# EAGLE design WirelessBuzzerv20 (EAGLE 6.5.0)
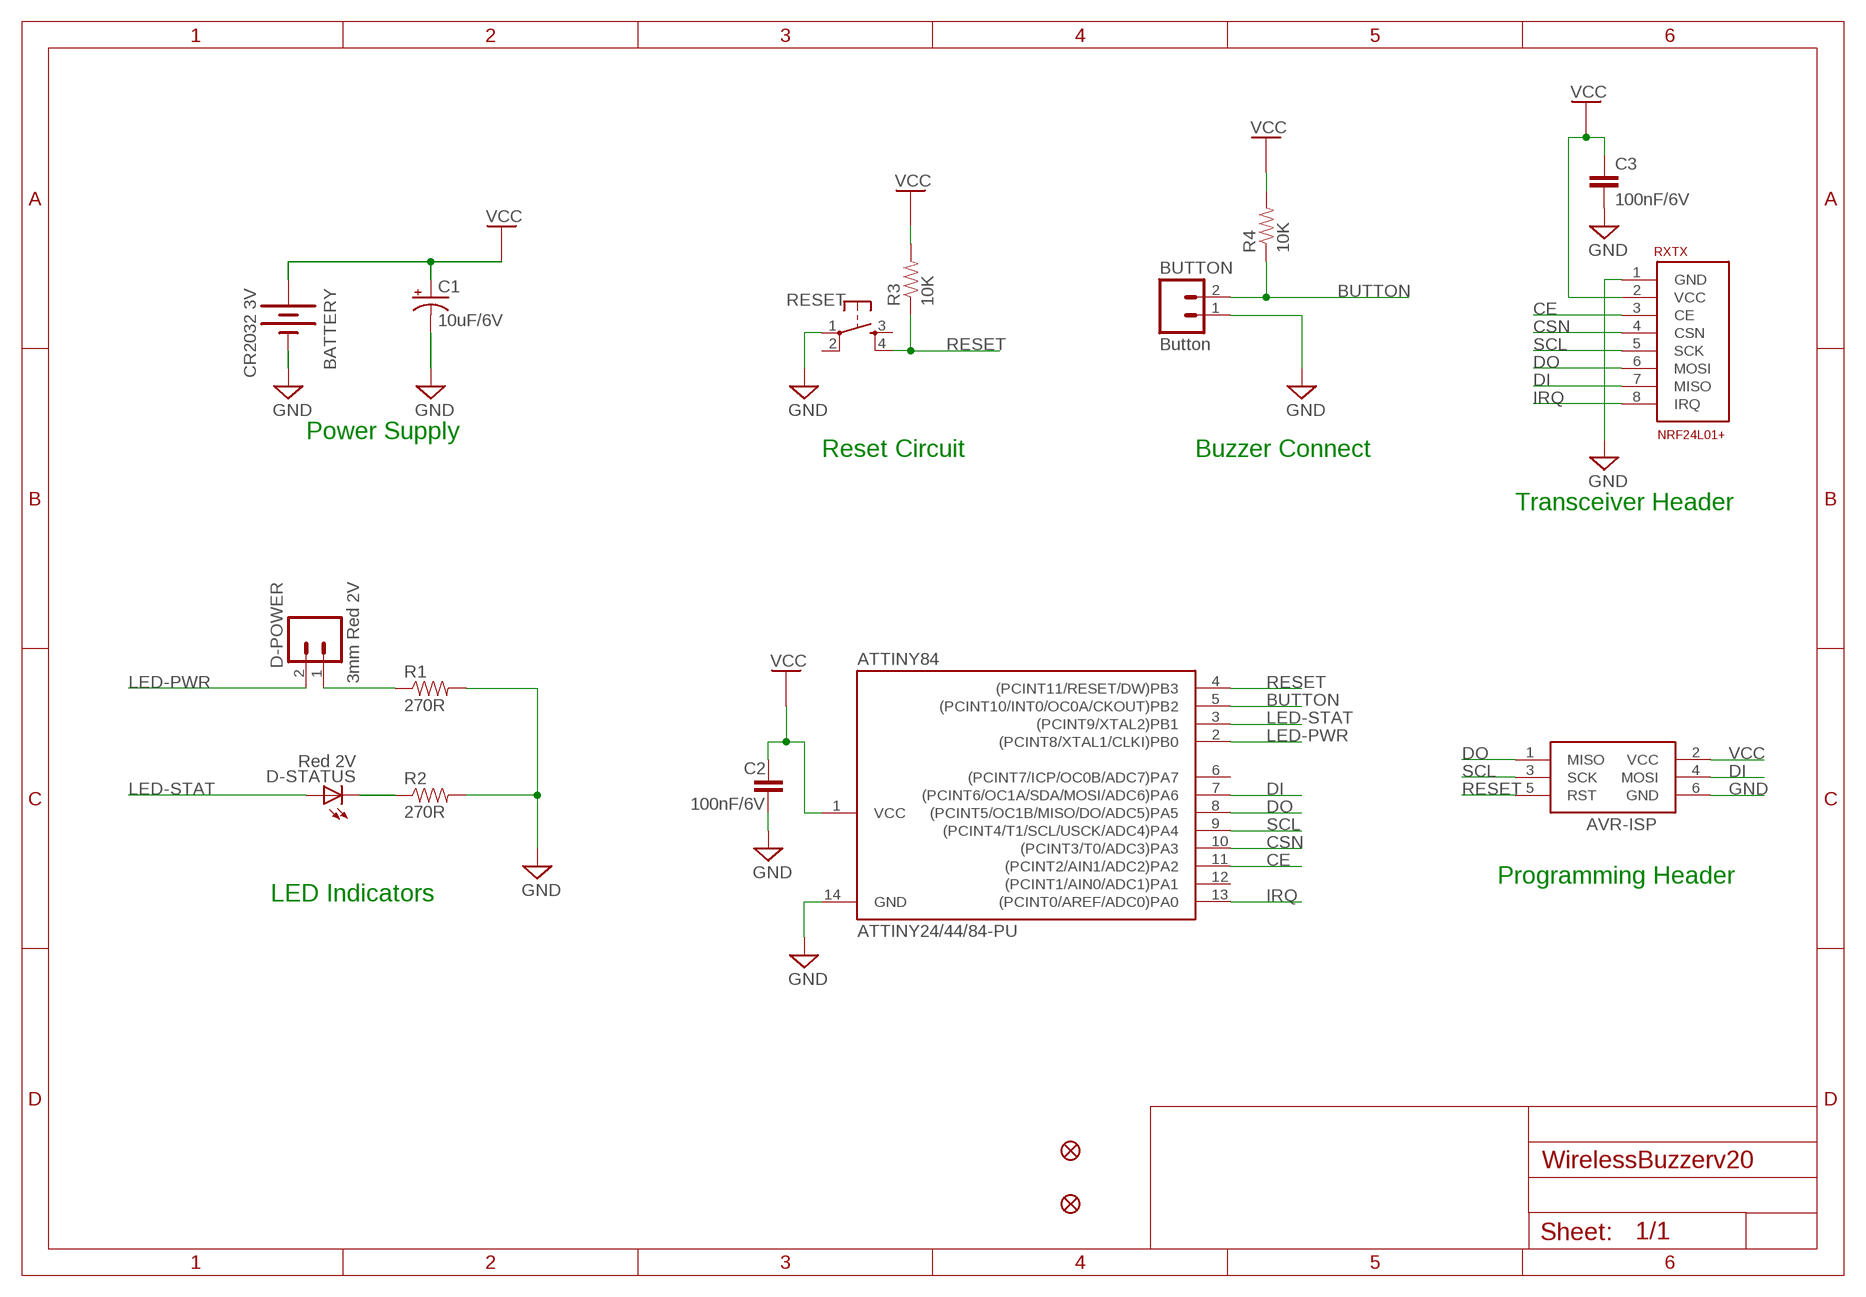
[diagram p0: schematic, sheet 1, part 1 of 2]
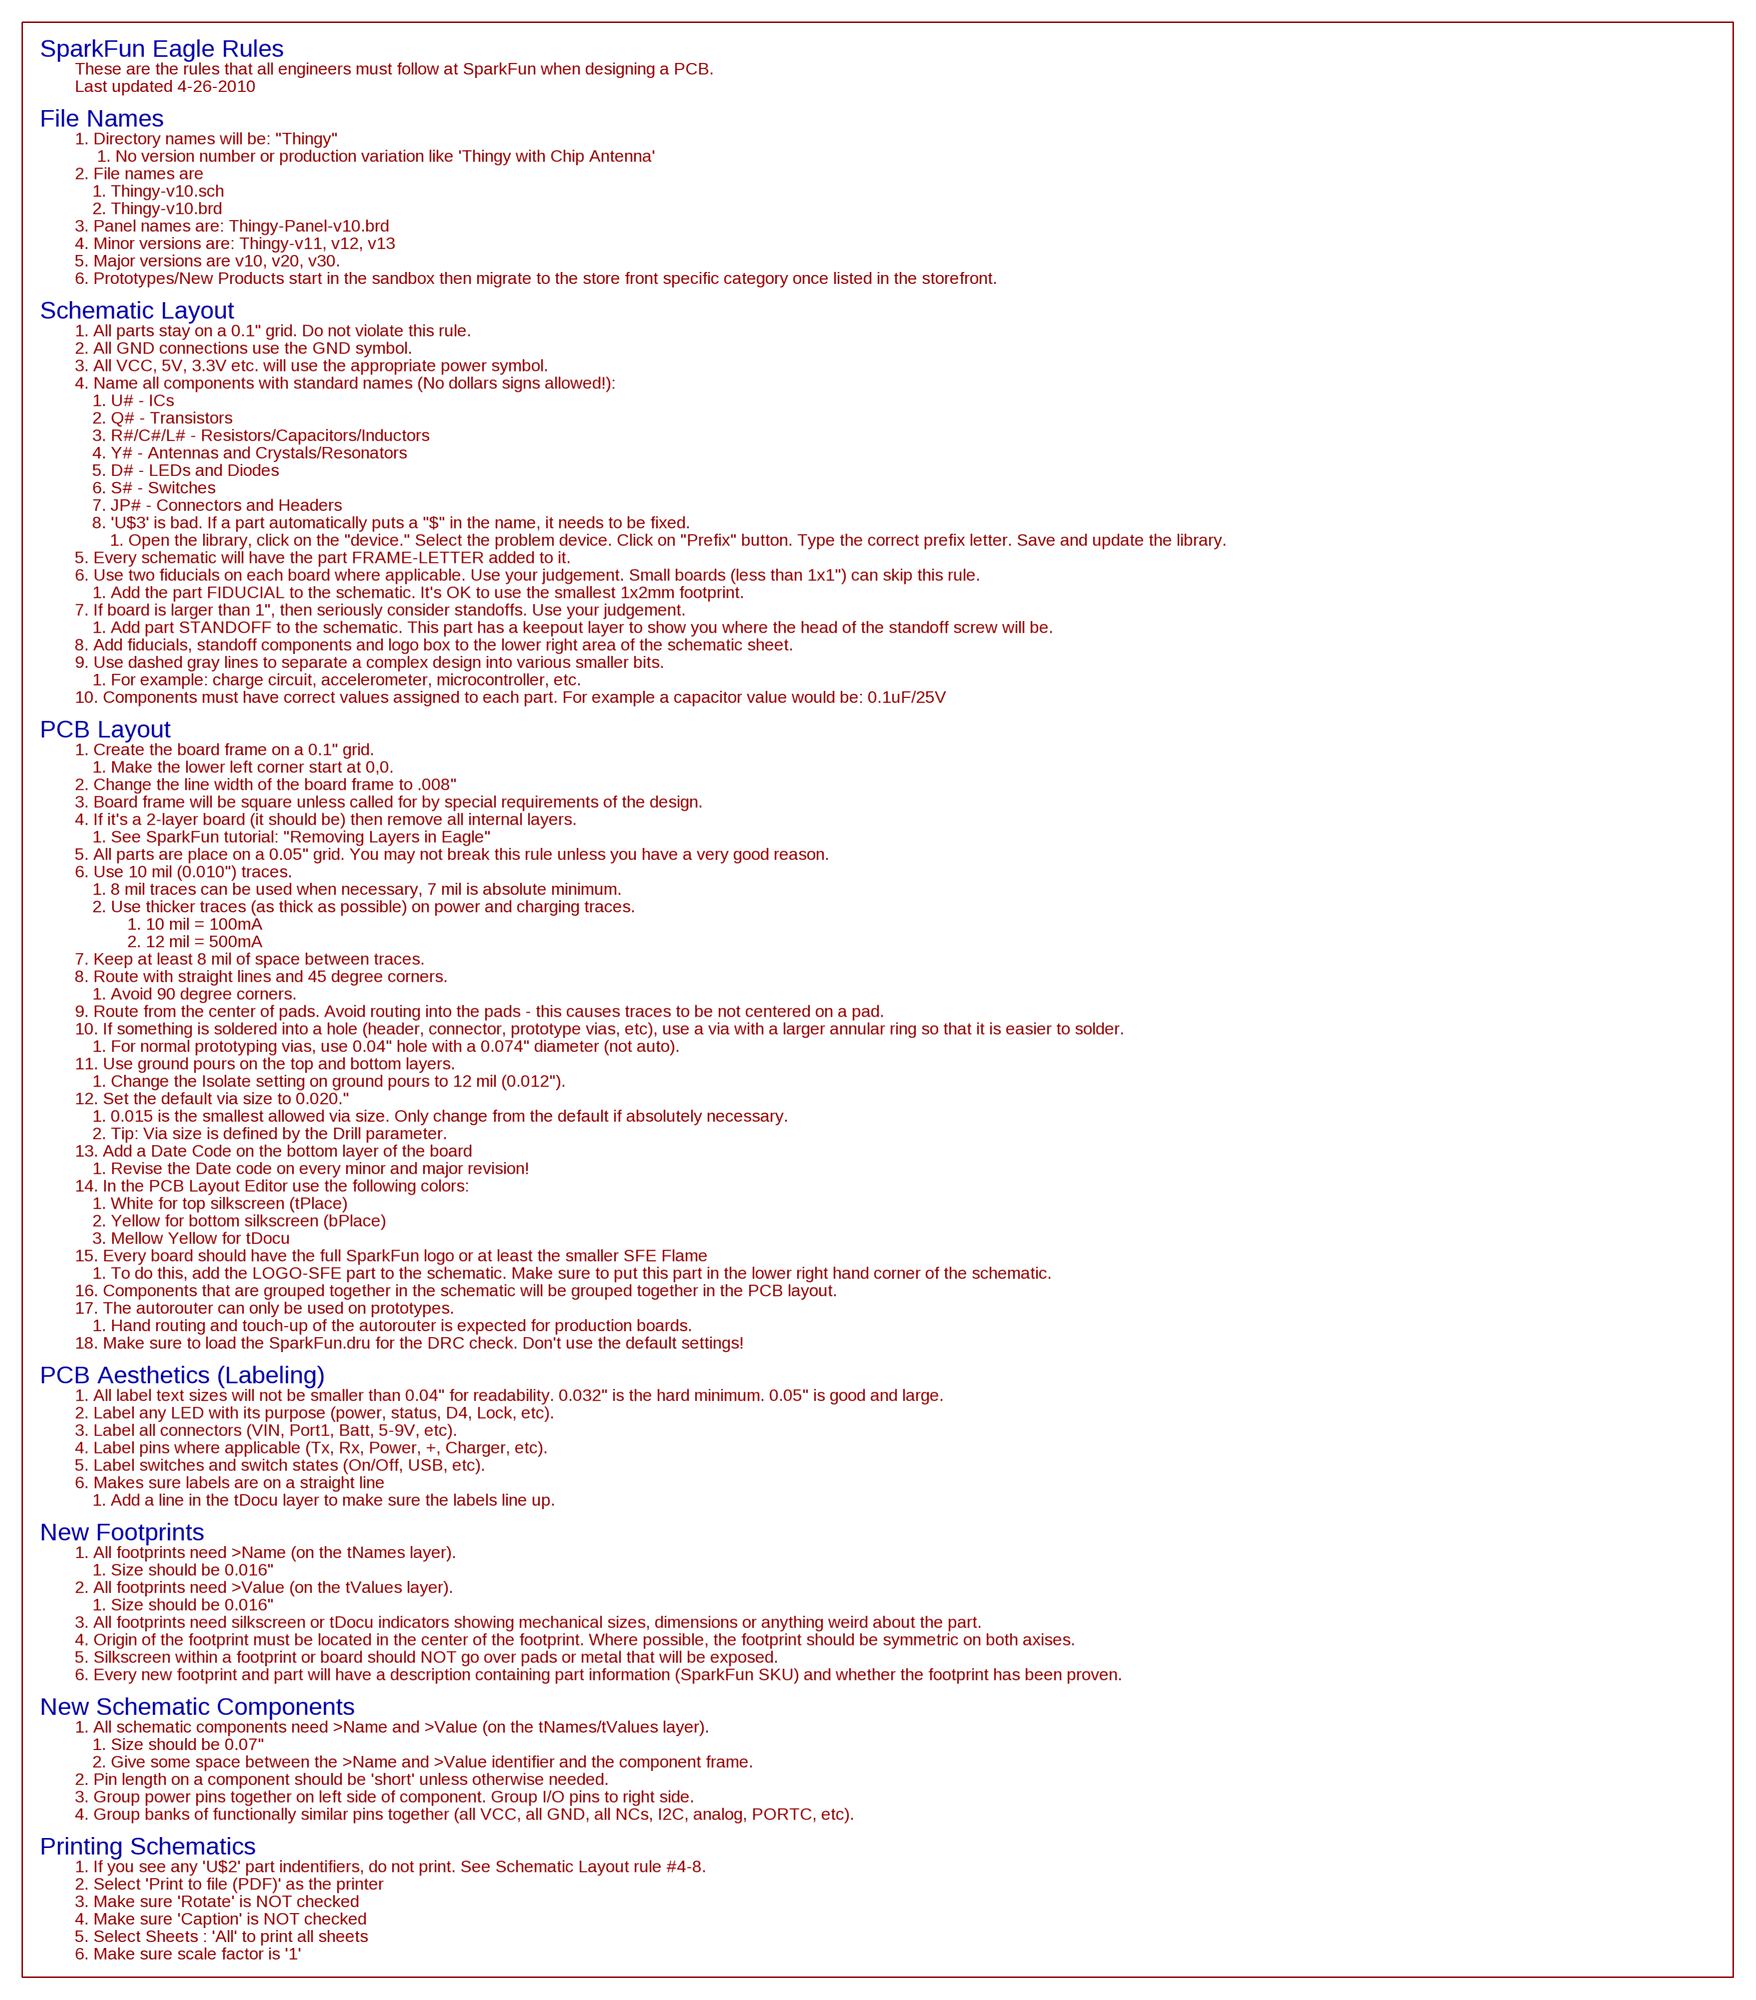
[diagram p1: schematic, sheet 1, part 2 of 2]

## Parts
ATTINY84  ATTINY24/44/84-PU  [DIL14]
AVR-ISP  AVRISP-6  [AVRISP]
BATTERY  CR2032 3V  BATTERY20PTH  [BATTCOM_20MM_PTH]
BUTTON  Button  M02PTH  [1X02]
C1  10uF/6V  CAP_POL3528-KIT  [EIA3528-KIT]
C2  100nF/6V  CAP1206  [1206]
C3  100nF/6V  CAP1206  [1206]
D-POWER  3mm Red 2V  M02PTH  [1X02]
D-STATUS  Red 2V  LED1206  [LED-1206]
FID1  FIDUCIAL1.5X3  [FIDUCIAL-1.5X3]
FID2  FIDUCIAL1.5X3  [FIDUCIAL-1.5X3]
R1  270R  RESISTOR1206  [1206]
R2  270R  RESISTOR1206  [1206]
R3  10K  RESISTOR1206  [1206]
R4  10K  RESISTOR1206  [1206]
RESET  DTSM-6  [DTSM-6]
RXTX  NRF24L01+  [NRF24L01+-HEADER]

## Nets
BUTTON: ATTINY84.5((PCINT10/INT0/OC0A/CKOUT)PB2) BUTTON.2 R4.1
CE: ATTINY84.11((PCINT2/AIN1/ADC2)PA2) RXTX.3(CE)
CSN: ATTINY84.10((PCINT3/T0/ADC3)PA3) RXTX.4(CSN)
DI: ATTINY84.7((PCINT6/OC1A/SDA/MOSI/ADC6)PA6) AVR-ISP.4(MOSI) RXTX.7(MISO)
DO: ATTINY84.8((PCINT5/OC1B/MISO/DO/ADC5)PA5) AVR-ISP.1(MISO) RXTX.6(MOSI)
GND: ATTINY84.14(GND) AVR-ISP.6(GND) BATTERY.2(-) BUTTON.1 C1.C(-) C2.2 C3.2 R1.2 R2.2 RESET.1 RXTX.1(GND)
IRQ: ATTINY84.13((PCINT0/AREF/ADC0)PA0) RXTX.8(IRQ)
LED-PWR: ATTINY84.2((PCINT8/XTAL1/CLKI)PB0) D-POWER.2
LED-STAT: ATTINY84.3((PCINT9/XTAL2)PB1) D-STATUS.A
N$1: D-POWER.1 R1.1
N$2: D-STATUS.C R2.1
RESET: ATTINY84.4((PCINT11/RESET/DW)PB3) AVR-ISP.5(RST) R3.1 RESET.4
SCL: ATTINY84.9((PCINT4/T1/SCL/USCK/ADC4)PA4) AVR-ISP.3(SCK) RXTX.5(SCK)
VCC: ATTINY84.1(VCC) AVR-ISP.2(VCC) BATTERY.1(+) C1.A(+) C2.1 C3.1 R3.2 R4.2 RXTX.2(VCC)
Unconnected: ATTINY84.6((PCINT7/ICP/OC0B/ADC7)PA7) ATTINY84.12((PCINT1/AIN0/ADC1)PA1) RESET.2 RESET.3

## Notes on the sheet
- Power Supply
- Reset Circuit | Buzzer Connect
- Transceiver Header
- Programming Header
- LED Indicators

## Library data of the parts
ATTINY84 = attiny24_44_84:ATTINY24/44/84
AVR-ISP = adafruit:AVRISP: AVR ISP HEADER Standard 6 pin header for AVR programming
BATTERY = SparkFun-Electromechanical:BATTERY: Battery Holders Various common sizes : AA, AAA, 20mm coin cell and 12mm coin cell. 20MM_4LEGS, BATT-10373
BUTTON D-POWER = SparkFun-Connectors:M02: Header 2 Standard 2-pin 0.1" header. Use with straight break away headers (SKU : PRT-00116), right angle break away headers (PRT-00553), swiss pins (PRT-00743), machine pins (PRT-00117), and female headers (PRT-00115). Molex polarized connector foot print use with SKU : PRT-08233 with associated crimp pins and housings.
C1 = SparkFun-Capacitors:CAP_POL: Capacitor Polarized These are standard SMD and PTH capacitors. Normally 10uF, 47uF, and 100uF in electrolytic and tantalum varieties. Always verify the external diameter of the through hole cap, it varies with capacity, voltage, and manufacturer. The EIA devices should be standard.
C2 C3 = SparkFun-Capacitors:CAP: Capacitor Standard 0603 ceramic capacitor, and 0.1" leaded capacitor.
D-STATUS = SparkFun-LED:LED: LEDs Standard schematic elements and footprints for 5mm, 3mm, 1206, and 0603 sized LEDs. 5mm - Spark Fun Electronics SKU : COM-00529 (and others)
FID1 FID2 = SparkFun-Aesthetics:FIDUCIAL: Fiducial Alignment Points Various fiducial points for machine vision alignment.
R1-R4 = SparkFun-Resistors:RESISTOR: Resistor Basic schematic elements and footprints for 0603, 1206, and PTH resistors.
RESET = switch-tact:DTSM-6
RXTX = Leenix:NRF24L01+

## Board
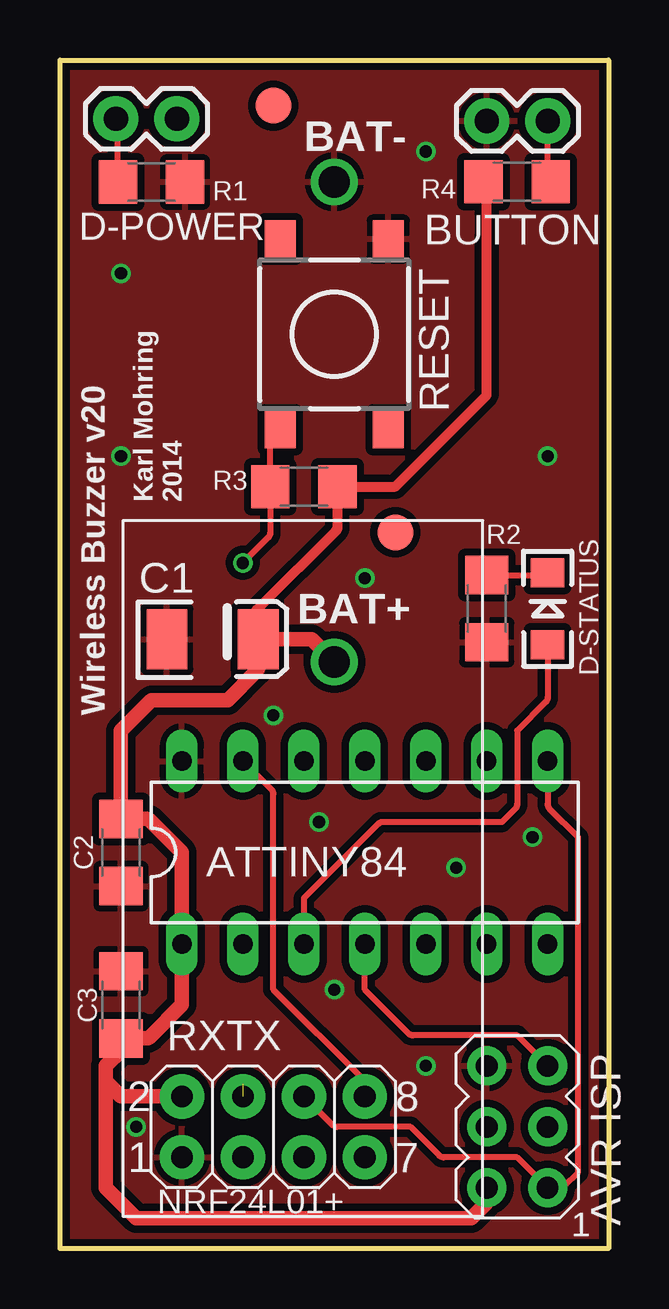
[diagram p2: board, top side]
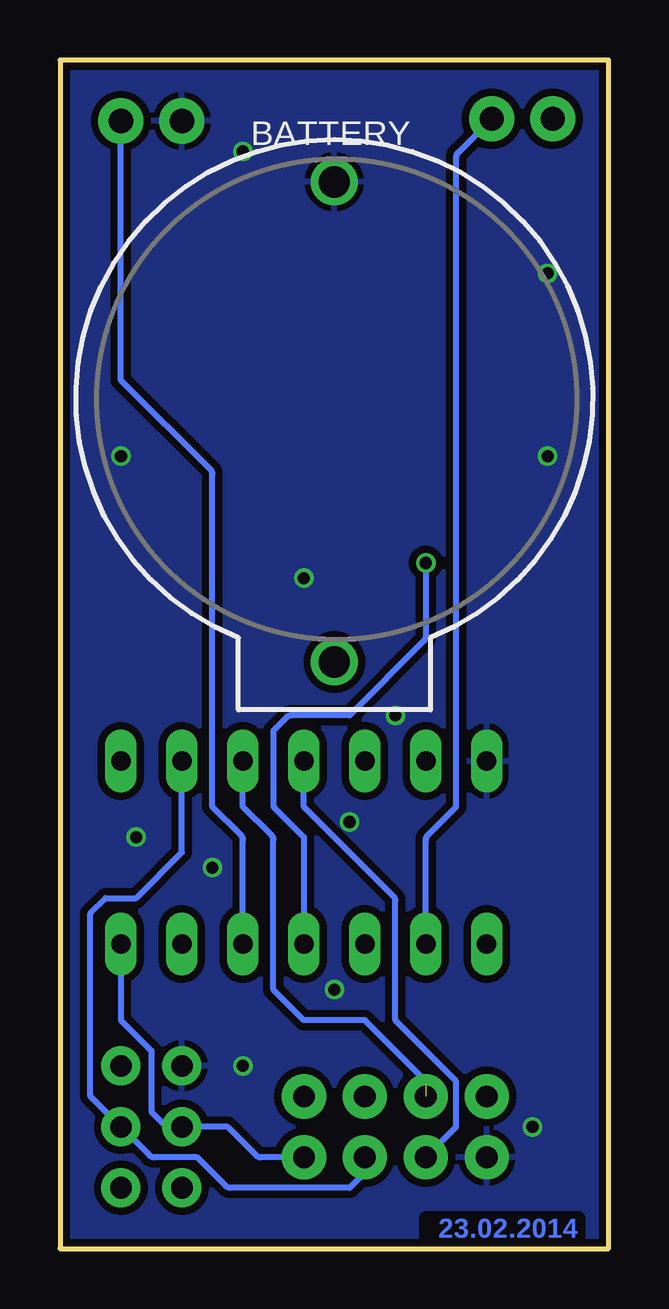
[diagram p3: board, bottom side, seen from below]

Size 22.86 x 49.53 mm. Coordinates in mm from the lower left corner, seen from the top.
Outline: 0,0 0,49.53 22.86,49.53 22.86,0 0,0
Copper layers (1*16): Top 0.035mm / dielectric 1.5mm / Bottom 0.035mm
Design rules "ITEADstudio_DRC": minimum track width 6mil, minimum drill 12mil, track to track 6mil, track to pad 6mil, pad to pad 6mil, via to via 6mil, smd to smd 0mil, copper to edge 10mil, drill to drill 10mil, minimum pad ring 10mil, minimum via ring 6mil, stop-mask expansion 2mil, vias tented up to drill 100mil, thermal gap 10mil

### Footprints (pad centres in the part's own frame; a part is rotated, then mirrored left to right if it is on the bottom)
DIL14 = drill 0.813 long: 1 -7.62,-3.81; 2 -5.08,-3.81; 3 -2.54,-3.81; 4 0,-3.81; 5 2.54,-3.81; 6 5.08,-3.81; 7 7.62,-3.81; 8 7.62,3.81; 9 5.08,3.81; 10 2.54,3.81; 11 0,3.81; 12 -2.54,3.81; 13 -5.08,3.81; 14 -7.62,3.81
AVRISP = drill 0.9 pad 1.626: 1 -1.27,2.54; 2 1.27,2.54; 3 -1.27,0; 4 1.27,0; 5 -1.27,-2.54; 6 1.27,-2.54
BATTCOM_20MM_PTH = drill 1.3: 1 20,0; 2 0,0
1X02 = drill 1.016 pad 1.88: 1 0,0; 2 2.54,0
EIA3528-KIT = smd 1.7 x 2.5: A 1.9,0; C -1.9,0
1206 = smd 1.6 x 1.8: 1 -1.4,0; 2 1.4,0
LED-1206 = smd 1.2 x 1.4: A -1.5,0; C 1.5,0
FIDUCIAL-1.5X3 = smd 1.5 x 1.5: 1 0,0
DTSM-6 = smd 1.55 x 1.3: 1 -3.975,2.25; 2 3.975,2.25; 3 -3.975,-2.25; 4 3.975,-2.25
NRF24L01+-HEADER = drill 0.9 pad 1.85: 1 -2.54,-2.54; 2 -2.54,0; 3 0,-2.54; 4 0,0; 5 2.54,-2.54; 6 2.54,0; 7 5.08,-2.54; 8 5.08,0

### Placement (x,y rotation side)
ATTINY84  12.7,16.51 0 top
AVR-ISP  19.05,5.08 180 top
BATTERY  11.43,44.45 270 bottom
BUTTON  17.78,46.99 0 top
C1  6.36,25.4 0 top
C2  2.54,16.51 270 top
C3  2.54,10.16 90 top
D-POWER  2.33,47.08 0 top
D-STATUS  20.32,26.67 90 top
FID1  8.89,47.62 0 top
FID2  13.97,29.84 0 top
R1  3.81,44.45 0 top
R2  17.78,26.67 270 top
R3  10.16,31.75 0 top
R4  19.05,44.45 180 top
RESET  11.43,38.1 270 top
RXTX  7.62,6.35 0 top

### Tracks (layer width: path | path; a pad name or v marks a point on that pad's centre or on a via)
BUTTON
  Top 0.254: R4.1 20.4,44.5 arc-45 20.32,44.68 BUTTON.2
  Bottom 0.254: ATTINY84.5 15.24,17.04 arc-45 15.31,17.22 16.51,18.41 16.51,32.28 arc-45 16.58,32.46 20.32,36.2 BUTTON.2 arc-45 BUTTON.2
CE
  Bottom 0.254: RXTX.3 6.35,5.08 6.35,6.88 arc-45 6.42,7.06 8.89,9.53 8.89,14.5 arc-45 8.96,14.68 12.7,18.41 ATTINY84.11
CSN  (1 unrouted)
  Bottom 0.254: 7.62,6.88 arc-45 7.69,7.06 10.16,9.53 12.7,9.53 13.97,10.79 13.97,17.04 arc-45 14.04,17.22 15.24,18.41 ATTINY84.10
DI
  Bottom 0.254: RXTX.7 14.5,3.81 arc45 14.68,3.88 15.88,5.08 AVR-ISP.4 18.31,5.08 arc45 18.49,5.15 19.05,5.71 19.05,8.26 20.32,9.53 ATTINY84.7
DO
  Top 0.254: RXTX.6 11.36,5.15 arc45 11.54,5.08 14.61,5.08 15.8,3.88 arc45 15.98,3.81 19.05,3.81 AVR-ISP.1 20.85,2.54 arc45 21.03,2.61 21.59,3.17 21.59,17.14 20.39,18.34 arc-45 20.32,18.52 ATTINY84.8
GND  (via drill 0.51)
  other vias: 11.43,10.79 10.79,17.78 2.54,33.02 2.54,40.64 15.24,45.72 20.32,33.02 12.7,27.94 15.24,7.62 16.51,15.88 19.68,17.14 3.17,5.08 8.89,22.23
  pour Bottom (isolate 0.305): 0,49.53 22.86,49.53 22.86,0 0,0
  pour Top (isolate 0.305): 0,49.53 22.86,49.53 22.86,0 0,0
IRQ
  Top 0.254: RXTX.8 12.7,6.88 arc45 12.63,7.06 8.89,10.79 8.89,18.95 arc45 8.82,19.12 ATTINY84.13
LED-PWR
  Bottom 0.254: ATTINY84.2 7.62,17.04 arc45 7.55,17.22 6.35,18.41 6.35,45.5 arc45 6.28,45.67 D-POWER.2
LED-STAT
  Top 0.254: ATTINY84.3 10.16,14.61 13.26,17.71 arc-45 13.44,17.78 18.41,17.78 18.98,18.34 arc45 19.05,18.52 19.05,21.59 20.25,22.79 arc45 20.32,22.96 D-STATUS.A
N$1
  Top 0.254: R1.1 2.41,46.9 arc45 D-POWER.1
N$2
  Top 0.254: R2.1 20.22,28.07 D-STATUS.C
RESET  (via drill 0.51)
  Top 0.254: AVR-ISP.5 19.05,8.89 14.71,8.89 arc-45 14.53,8.96 12.7,10.79 ATTINY84.4 | v7.62,28.57 8.69,29.64 arc45 8.76,29.82 R3.1 8.76,33.7 RESET.4
  Bottom 0.254: v7.62,28.57 7.62,25.5 arc45 7.69,25.33 10.79,22.23 13.23,22.23 arc-45 13.41,22.15 13.97,21.59 13.97,18.52 arc-45 13.9,18.34 12.7,17.14 ATTINY84.4
SCL
  Bottom 0.254: RXTX.5 10.16,3.28 arc45 10.23,3.1 10.79,2.54 15.77,2.54 arc45 15.95,2.61 17.14,3.81 18.95,3.81 arc45 19.12,3.88 AVR-ISP.3 21.59,6.35 21.59,13.97 20.95,14.61 19.68,14.61 17.78,16.51 ATTINY84.9
VCC
  Top 0.406: 8.26,26.57 arc-45 8.33,26.75 11.49,29.9 arc45 11.56,30.08 R3.2 arc-45 R3.2 13.97,31.75 17.71,35.49 arc45 17.78,35.66 17.78,44.21 arc45 17.71,44.39 R4.2
  Top 0.61: AVR-ISP.2 17.78,2.01 arc-45 17.71,1.83 17.14,1.27 3.17,1.27 1.91,2.54 1.91,6.99 | C1.A 10.48,25.4 BATTERY.1 | 1.91,6.99 1.91,7.62 2.54,8.26 C3.1 3.58,8.76 arc45 3.75,8.83 5.08,10.16 ATTINY84.1 5.08,16.51 3.75,17.84 arc45 3.58,17.91 C2.1 2.54,21.59 3.74,22.79 arc-45 3.92,22.86 6.99,22.86 8.18,24.06 arc45 8.26,24.24 C1.A | RXTX.2 2.54,6.35 1.91,6.99 | 8.26,26.57 C1.A

### Text on the board
Bottom: 23.02.2014
tPlace: BAT- | Karl Mohring / 2014 | BAT+ | Wireless Buzzer v20